# Altium schematic sheet 03_Vehicle_Interfaces.SchDoc: Vehicle Interfaces
size A4; DrawnBy: YILDIRIM_DOGRU
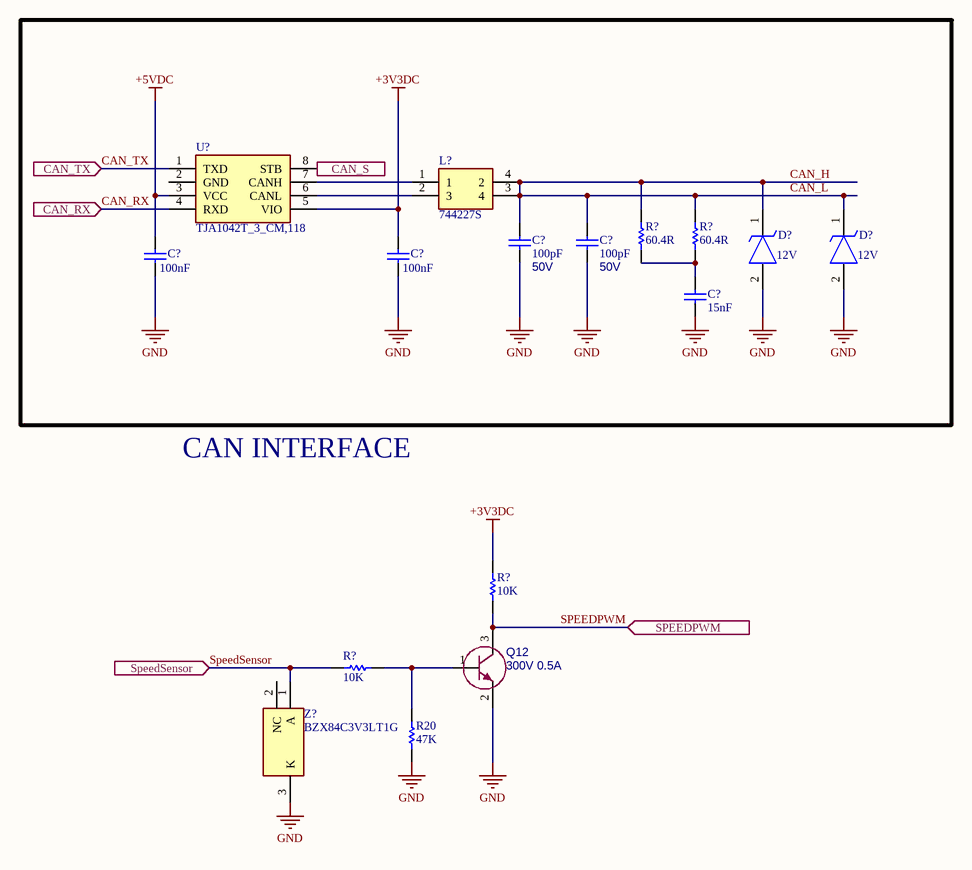
[diagram p0: 03_Vehicle_Interfaces.SchDoc]

## Parts
(Parts that share a designator on the sheet are numbered #1, #2 ... from top to bottom, then left to right.)
C?#1  value 100pF  Voltage: 50V  [CAP_0402]  (hidden comment: CC0402JRNPO9BN101)
C?#2  value 100pF  Voltage: 50V  [CAP_0402]  (hidden comment: CC0402JRNPO9BN101)
C?#3  value 100nF  [CAP_0603]  (hidden comment: CL10B104KB8NNNL)
C?#4  value 100nF  [CAP_0603]  (hidden comment: CL10B104KB8NNNL)
C?#5  value 15nF  [CAP_0603]  (hidden comment: CL10B153KB85PNC)
D?#1  value 12V  [DIOM5436X244N]  (hidden comment: SMBJ12A)
D?#2  value 12V  [DIOM5436X244N]  (hidden comment: SMBJ12A)
L?  744227S  [WE-SL274]
Q12  value 300V 0.5A  [SOT-23-3]  (hidden comment: MMBTA42_R1_00001)
R20  value 47K  [RES_0603]  (hidden comment: 0603SAF4702T5E)
R?#1  value 60.4R  [RES_0603]  (hidden comment: 0603SAF604JT5E)
R?#2  value 60.4R  [RES_0603]  (hidden comment: 0603SAF604JT5E)
R?#3  value 10K  [RES_0402]  (hidden comment: RC0402JR-0710KL)
R?#4  value 10K  [RES_0402]  (hidden comment: RC0402JR-0710KL)
U?  TJA1042T_3_CM,118  [SOIC127P600X175-8N]
Z?  BZX84C3V3LT1G  [SOT96P237X111-3N]

## Ports
CAN_RX (in), CAN_S (in), CAN_TX (in), SPEEDPWM (in), SpeedSensor (in)

## Nets
+3V3DC: C?#4.2 R?#3.1 U?.5(VIO)
+5VDC: C?#3.2 U?.3(VCC)
GND: C?#1.2 C?#2.2 C?#3.1 C?#4.1 C?#5.1 D?#1.2(A) D?#2.2(A) Q12.2(E) R20.1 Z?.3(K)
CAN_H: C?#1.1 C?#2.1 D?#1.1(K) D?#2.1(K) L?.3(4) L?.4(2) R?#1.2 R?#2.2  [also labelled CAN_L]
CAN_RX: U?.4(RXD) ; port CAN_RX
CAN_S: U?.8(STB) ; port CAN_S
CAN_TX: U?.1(TXD) ; port CAN_TX
SPEEDPWM: Q12.3(C) R?#3.2 ; port SPEEDPWM
SpeedSensor: R?#4.1 Z?.1(A) ; port SpeedSensor
NetC?#5_2: C?#5.2 R?#1.1 R?#2.1
NetL?_1: L?.1 U?.7(CANH)
NetL?_2: L?.2(3) U?.6(CANL)
NetQ12_1: Q12.1(B) R20.2 R?#4.2

Not connected (* = marked no-connect by the designer): U? 2(GND); Z? 2(NC)

## Notes on the sheet
- CAN INTERFACE
- Title
- Size:
- Date:
- A4
- Drawn By:
- Number:
- Revision:
- File:

## Library data of the parts
C?#1 C?#2 = CL10B103KB8NNNL: MLCC (1005) 0402 100pF 50VDC ±5% C0G (NP0); Manufacturer: YAGEO; Manufacturer Part Number: CC0402JRNPO9BN101
C?#3 C?#4 = CL10B104KB8NNNL: MLCC (1608) 0603 100nF 50VDC ±10% X7R; Manufacturer: Samsung Electro-Mechanics America, Inc; Supplier 1: OZDISAN; Manufacturer Part Number: CL10B104KB8NNNL
C?#5 = CL10B153KB85PNC: MLCC (1608) 0603 15nF 50VDC ±10% X7R AUTOMOTIVE; Manufacturer: SAMSUNG; Supplier 1: OZDISAN; Manufacturer Part Number: CL10B153KB85PNC
D?#1 D?#2 = SMBJ12A: TVS, UNI-DIR, 600W, 12V, DO-214A; Manufacturer: Good-Ark Semiconductor; Manufacturer Part Number: SMBJ12A
L? = 744227S: Inductor; Manufacturer_Name: Wurth Elektronik; Datasheet Link: https://www.we-online.com/catalog/datasheet/744227S.pdf; Height: 5mm; Manufacturer_Part_Number: 744227S; Mouser Part Number: 710-744227S; Mouser Price/Stock: https://www.mouser.co.uk/ProductDetail/Wurth-Elektronik/744227S?qs=PGXP4M47uW6UzRbcLRn7mw%3D%3D
Q12 = MMBTA42_R1_00001: TRANSISTOR DIS.500mA 300V NPN SOT23 GEN. SMT; Manufacturer: PANJIT; Package: SOT23; Supplier Part Number 1: 3757-MMBTA42_R1_00001CT-ND; Supplier Part Number 2: *; Supplier Part Number 3: MMBTA42_R1_00001; Supplier 1: DIGIKEY; Supplier 2: MOUSER; Supplier 3: OZDISAN; Manufacturer Part Number: MMBTA42_R1_00001
R20 = 0603SAF4702T5E: RES.(1608) 0603 47K Ohms 1% 1/10W-S 100PPM; Manufacturer: ROYALOHM; Supplier 1: Ozdisan; Manufacturer Part Number: 0603SAF4702T5E
R?#1 R?#2 = 0603SAJ0220T5E: RES.(1608) 0603 60.4 Ohms 1% 1/10W-S 200PPM; Manufacturer: ROYALOHM; Supplier 1: Ozdisan; Manufacturer Part Number: 0603SAF604JT5E
R?#3 R?#4 = R03000: RES.(1005) 0402 10K Ohms 5% 1/16W 100PPM SMT; Manufacturer: YAGEO; Manufacturer Part Number: RC0402JR-0710KL
U? = TJA1042T_3_CM,118: Integrated Circuit; Manufacturer_Name: NXP; Manufacturer_Part_Number: TJA1042T/3/CM,118; Datasheet Link: http://www.nxp.com/docs/en/data-sheet/TJA1042.pdf; Height: 1.75mm; Mouser Part Number: 771-TJA1042T/3/CM118; Mouser Price/Stock: https://www.mouser.co.uk/ProductDetail/NXP-Semiconductors/TJA1042T-3-CM118?qs=vbj%2FKoHZRAjPcMNWVApm4A%3D%3D; Arrow Part Number: TJA1042T/3/CM,118; Arrow Price/Stock: https://www.arrow.com/en/products/tja1042t3cm118/nxp-semiconductors.html?utm_currency=USD&region=nac
Z? = BZX84C3V3LT1G: Zener Diode; Manufacturer_Name: onsemi; Datasheet Link: https://www.onsemi.com/pub/Collateral/BZX84C2V4LT1-D.PDF; Height: 1.11mm; Manufacturer_Part_Number: BZX84C3V3LT1G; Mouser Part Number: 863-BZX84C3V3LT1G; Mouser Price/Stock: https://www.mouser.co.uk/ProductDetail/onsemi/BZX84C3V3LT1G?qs=vNc2DXHODiIKL62%252Be6h8Pg%3D%3D; Arrow Part Number: BZX84C3V3LT1G; Arrow Price/Stock: https://www.arrow.com/en/products/bzx84c3v3lt1g/on-semiconductor.html?utm_currency=USD&region=nac